# EAGLE design 1_Main (EAGLE 7.6.0)
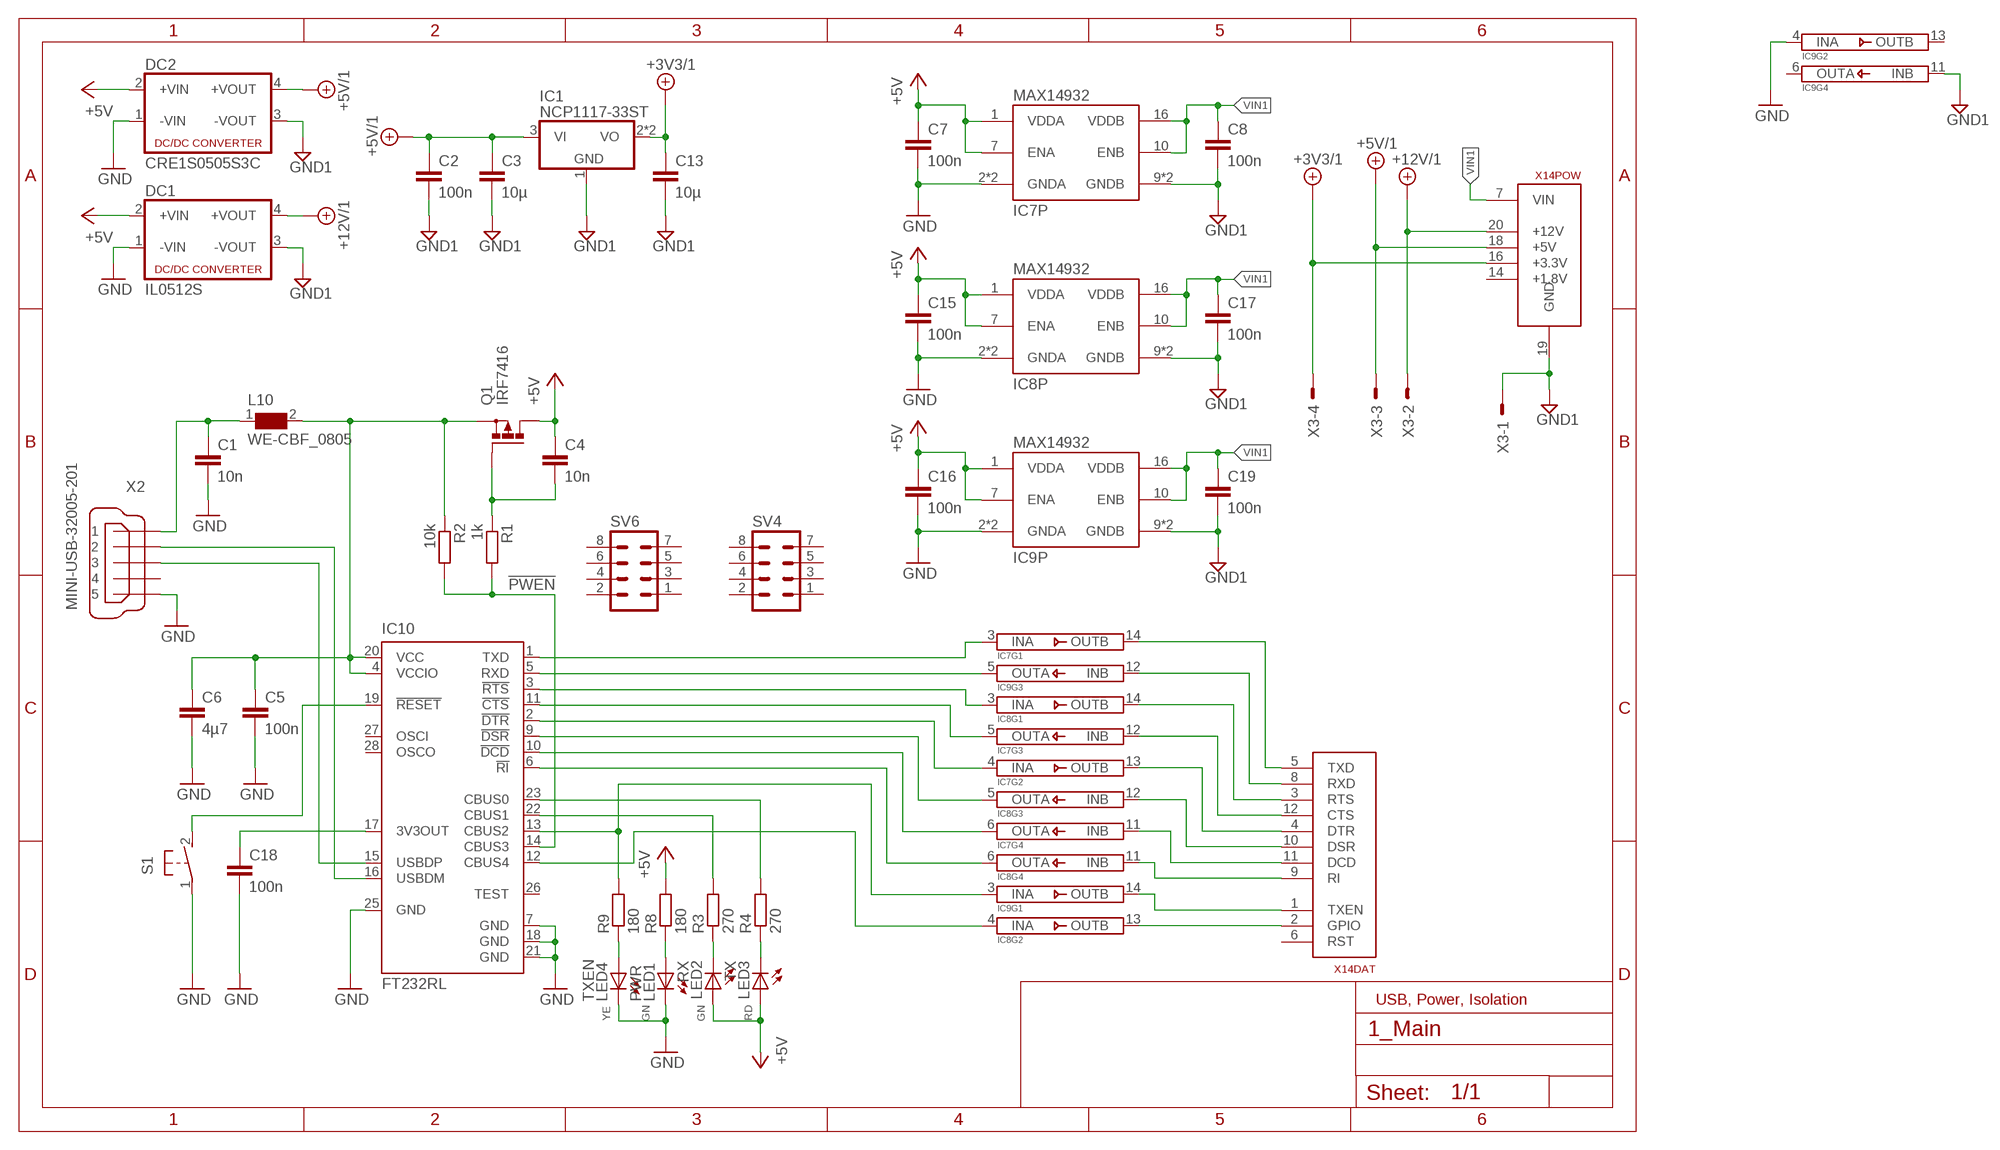
[diagram p0: schematic, sheet 1]

## Parts
C1  10n  C-EUC0805  [C0805]
C2  100n  C-EUC0805  [C0805]
C3  10µ  C-EUC0805  [C0805]
C4  10n  C-EUC0805  [C0805]
C5  100n  C-EUC0805  [C0805]
C6  4µ7  C-EUC0805  [C0805]
C7  100n  C-EUC0805  [C0805]
C8  100n  C-EUC0805  [C0805]
C13  10µ  C-EUC0805  [C0805]
C15  100n  C-EUC0805  [C0805]
C16  100n  C-EUC0805  [C0805]
C17  100n  C-EUC0805  [C0805]
C18  100n  C-EUC0805  [C0805]
C19  100n  C-EUC0805  [C0805]
DC1  IL0512S  NME  [NME]
DC2  CRE1S0505S3C  NME  [NME]
IC1  NCP1117-33ST  [SOT223]
IC7  MAX14932  [SO16]
IC8  MAX14932  [SO16]
IC9  MAX14932  [SO16]
IC10  FT232RL  [SSOP28]
L10  WE-CBF_0805  [0805]
LED1  PWR  LEDCHIPLED_0603  [CHIPLED_0603]
LED2  RX  LEDCHIPLED_0603  [CHIPLED_0603]
LED3  TX  LEDCHIPLED_0603  [CHIPLED_0603]
LED4  TXEN  LEDCHIPLED_0603  [CHIPLED_0603]
Q1  IRF7416  P-MOSFET-SO8  [SO-08]
R1  1k  R-EU_R0805  [R0805]
R2  10k  R-EU_R0805  [R0805]
R3  270  R-EU_R0805  [R0805]
R4  270  R-EU_R0805  [R0805]
R8  180  R-EU_R0805  [R0805]
R9  180  R-EU_R0805  [R0805]
S1  31-XX  [B3F-31XX]
SV4  MA04-2  [MA04-2]
SV6  MA04-2  [MA04-2]
X2  MINI-USB-32005-201  [32005-201]
X3  AKL18X-04W  [AKL182-04]
X14  ALLSERIALMM  [MAIN-THT]

## Nets
!PWEN: IC10.14(CBUS3) R1.2 R2.2
+3V3/1: C13.1 IC1.2(VO) IC1.4(VO) X3.P$4 X14.16(POW:+3.3V)
+5V: C4.1 C7.1 C15.1 C16.1 DC1.2(+VIN) DC2.2(+VIN) IC7.1(P:VDDA) IC7.7(P:ENA) IC8.1(P:VDDA) IC8.7(P:ENA) IC9.1(P:VDDA) IC9.7(P:ENA) LED2.A LED3.A Q1.5(D) Q1.6(D) Q1.7(D) Q1.8(D) R8.2
+5V/1: C2.1 C3.1 DC2.4(+VOUT) IC1.3(VI) X3.P$3 X14.18(POW:+5V)
+12V/1: DC1.4(+VOUT) X3.P$2 X14.20(POW:+12V)
GND: C1.2 C5.2 C6.2 C7.2 C15.2 C16.2 C18.2 DC1.1(-VIN) DC2.1(-VIN) IC7.2(P:GNDA) IC7.8(P:GNDA) IC8.2(P:GNDA) IC8.8(P:GNDA) IC9.2(P:GNDA) IC9.4(INA) IC9.8(P:GNDA) IC10.7(GND) IC10.18(GND) IC10.21(GND) IC10.25(GND) LED1.C LED4.C S1.1(P) X2.5
GND1: C2.2 C3.2 C8.2 C13.2 C17.2 C19.2 DC1.3(-VOUT) DC2.3(-VOUT) IC1.1(GND) IC7.9(P:GNDB) IC7.15(P:GNDB) IC8.9(P:GNDB) IC8.15(P:GNDB) IC9.9(P:GNDB) IC9.11(INB) IC9.15(P:GNDB) X3.P$1 X14.19(POW:GND)
N$3: IC9.3(INA) IC10.13(CBUS2) R9.2
N$4: LED3.C R4.1
N$5: IC10.19(!RESET) S1.2(S)
N$6: LED2.C R3.1
N$7: LED4.A R9.1
N$8: LED1.A R8.1
N$11: C1.1 L10.1 X2.1
N$13: IC8.4(INA) IC10.12(CBUS4)
N$14: IC7.3(INA) IC10.1(TXD)
N$19: IC10.16(USBDM) X2.2
N$20: IC9.5(OUTA) IC10.5(RXD)
N$21: IC10.15(USBDP) X2.3
N$22: C18.1 IC10.17(3V3OUT)
N$29: IC8.3(INA) IC10.3(!RTS)
N$32: IC7.5(OUTA) IC10.11(!CTS)
N$33: IC7.4(INA) IC10.2(!DTR)
N$34: IC8.5(OUTA) IC10.9(!DSR)
N$35: IC7.6(OUTA) IC10.10(!DCD)
N$36: IC8.6(OUTA) IC10.6(!RI)
N$38: C5.1 C6.1 IC10.4(VCCIO) IC10.20(VCC) L10.2 Q1.1(S) Q1.2(S) Q1.3(S) R2.1
N$42: C4.2 Q1.4(G) R1.1
N$80: IC7.14(OUTB) X14.5(DAT:TXD)
N$81: IC9.12(INB) X14.8(DAT:RXD)
N$82: IC8.14(OUTB) X14.3(DAT:RTS)
N$83: IC7.12(INB) X14.12(DAT:CTS)
N$84: IC7.13(OUTB) X14.4(DAT:DTR)
N$85: IC8.12(INB) X14.10(DAT:DSR)
N$86: IC7.11(INB) X14.11(DAT:DCD)
N$87: IC8.11(INB) X14.9(DAT:RI)
N$88: IC9.14(OUTB) X14.1(DAT:TXEN)
N$89: IC8.13(OUTB) X14.2(DAT:GPIO)
RXLED: IC10.22(CBUS1) R3.2
TXLED: IC10.23(CBUS0) R4.2
VIN1: C8.1 C17.1 C19.1 IC7.10(P:ENB) IC7.16(P:VDDB) IC8.10(P:ENB) IC8.16(P:VDDB) IC9.10(P:ENB) IC9.16(P:VDDB) X14.7(POW:VIN)
Unconnected: IC9.6(OUTA) IC9.13(OUTB) IC10.26(TEST) IC10.27(OSCI) IC10.28(OSCO) SV4.1 SV4.2 SV4.3 SV4.4 SV4.5 SV4.6 SV4.7 SV4.8 SV6.1 SV6.2 SV6.3 SV6.4 SV6.5 SV6.6 SV6.7 SV6.8 X2.4 X14.6(DAT:RST) X14.14(POW:+1.8V)

## Notes on the sheet
- USB, Power, Isolation

## Library data of the parts
C1-C8 C13 C15-C19 = rcl:C-EU: CAPACITOR, European symbol
DC1 DC2 = dc-dc-converter:NME: DC-DC CONVERTER; MF: C & D TECHNOLOGIES, INC; MPN: NME1205D; OC_FARNELL: 1021466; OC_NEWARK: 98B8198
IC1 = linear:NCP1117
IC7-IC9 = max14932:MAX14932
IC10 = ftdichip:FT232R: Source: http://www.ftdichip.com/Documents/DataSheets/DS_FT232R_v104.pdf; MPN: FT232RL; OC_FARNELL: 1146032; OC_NEWARK: 91K9918
L10 = EagleLibrary_Wuerth_Elektronik_eiSos_Version_6-12:WE-CBF: SMD EMI Suppression Ferrite Beads WE-CBF - Excellent anti-EMI properties - Low DC-restistance - Impedances till 3000 ohms - Rated current up to 6 A -- Reliable Ni-Sn electrodes -- Perfect as data lined filter and for uncoupling of distribution voltage
LED1 LED2 = led:LED: LED OSRAM: - CHIPLED LG R971, LG N971, LY N971, LG Q971, LY Q971, LO R971, LY R971 LH N974, LH R974 LS Q976, LO Q976, LY Q976 LO Q996 - Hyper CHIPLED LW Q18S LB Q993, LB Q99A, LB R99A - SideLED LS A670, LO A670, LY A670, LG A670, LP A670 LB A673, LV A673, LT A673, LW A673 LH A674 LY A675 LS A676, LA A676, LO A676, LY A676, LW A676 LS A679, LY A679, LG A679 - Hyper Micro SIDELED® LS Y876, LA Y876, LO Y876, LY Y876 LT Y87S - SmartLED LW L88C, LW L88S LB L89C, LB L89S, LG L890 LS L89K, LO L89K, LY L89K LS L896, LA L896, LO L896, LY L896 - TOPLED LS T670, LO T670, LY T670, LG T670, LP T670 LSG T670, LSP T670, LSY T670, LOP T670, LYG T670 LG T671, LOG T671, LSG T671 LB T673, LV T673, LT T673, LW T673 LH T674 LS T676, LA T676, LO T676, LY T676, LB T676, LH T676, LSB T676, LW T676 LB T67C, LV T67C, LT T67C, LS T67K, LO T67K, LY T67K, LW E67C LS E67B, LA E67B, LO E67B, LY E67B, LB E67C, LV E67C, LT E67C LW T67C LS T679, LY T679, LG T679 LS T770, LO T770, LY T770, LG T770, LP T770 LB T773, LV T773, LT T773, LW T773 LH T774 LS E675, LA E675, LY E675, LS T675 LS T776, LA T776, LO T776, LY T776, LB T776 LHGB T686 LT T68C, LB T68C - Hyper Mini TOPLED® LB M676 - Mini TOPLED Santana® LG M470 LS M47K, LO M47K, LY M47K Source: http://www.osram.convergy.de LUXEON: - LUMILED® LXK2-PW12-R00, LXK2-PW12-S00, LXK2-PW14-U00, LXK2-PW14-V00 LXK2-PM12-R00, LXK2-PM12-S00, LXK2-PM14-U00 LXK2-PE12-Q00, LXK2-PE12-R00, LXK2-PE12-S00, LXK2-PE14-T00, LXK2-PE14-U00 LXK2-PB12-K00, LXK2-PB12-L00, LXK2-PB12-M00, LXK2-PB14-N00, LXK2-PB14-P00, LXK2-PB14-Q00 LXK2-PR12-L00, LXK2-PR12-M00, LXK2-PR14-Q00, LXK2-PR14-R00 LXK2-PD12-Q00, LXK2-PD12-R00, LXK2-PD12-S00 LXK2-PH12-R00, LXK2-PH12-S00 LXK2-PL12-P00, LXK2-PL12-Q00, LXK2-PL12-R00 Source: www.luxeon.com KINGBRIGHT: KA-3528ASYC Source: www.kingbright.com; COLOR: GN
LED3 = led:LED: LED OSRAM: - CHIPLED LG R971, LG N971, LY N971, LG Q971, LY Q971, LO R971, LY R971 LH N974, LH R974 LS Q976, LO Q976, LY Q976 LO Q996 - Hyper CHIPLED LW Q18S LB Q993, LB Q99A, LB R99A - SideLED LS A670, LO A670, LY A670, LG A670, LP A670 LB A673, LV A673, LT A673, LW A673 LH A674 LY A675 LS A676, LA A676, LO A676, LY A676, LW A676 LS A679, LY A679, LG A679 - Hyper Micro SIDELED® LS Y876, LA Y876, LO Y876, LY Y876 LT Y87S - SmartLED LW L88C, LW L88S LB L89C, LB L89S, LG L890 LS L89K, LO L89K, LY L89K LS L896, LA L896, LO L896, LY L896 - TOPLED LS T670, LO T670, LY T670, LG T670, LP T670 LSG T670, LSP T670, LSY T670, LOP T670, LYG T670 LG T671, LOG T671, LSG T671 LB T673, LV T673, LT T673, LW T673 LH T674 LS T676, LA T676, LO T676, LY T676, LB T676, LH T676, LSB T676, LW T676 LB T67C, LV T67C, LT T67C, LS T67K, LO T67K, LY T67K, LW E67C LS E67B, LA E67B, LO E67B, LY E67B, LB E67C, LV E67C, LT E67C LW T67C LS T679, LY T679, LG T679 LS T770, LO T770, LY T770, LG T770, LP T770 LB T773, LV T773, LT T773, LW T773 LH T774 LS E675, LA E675, LY E675, LS T675 LS T776, LA T776, LO T776, LY T776, LB T776 LHGB T686 LT T68C, LB T68C - Hyper Mini TOPLED® LB M676 - Mini TOPLED Santana® LG M470 LS M47K, LO M47K, LY M47K Source: http://www.osram.convergy.de LUXEON: - LUMILED® LXK2-PW12-R00, LXK2-PW12-S00, LXK2-PW14-U00, LXK2-PW14-V00 LXK2-PM12-R00, LXK2-PM12-S00, LXK2-PM14-U00 LXK2-PE12-Q00, LXK2-PE12-R00, LXK2-PE12-S00, LXK2-PE14-T00, LXK2-PE14-U00 LXK2-PB12-K00, LXK2-PB12-L00, LXK2-PB12-M00, LXK2-PB14-N00, LXK2-PB14-P00, LXK2-PB14-Q00 LXK2-PR12-L00, LXK2-PR12-M00, LXK2-PR14-Q00, LXK2-PR14-R00 LXK2-PD12-Q00, LXK2-PD12-R00, LXK2-PD12-S00 LXK2-PH12-R00, LXK2-PH12-S00 LXK2-PL12-P00, LXK2-PL12-Q00, LXK2-PL12-R00 Source: www.luxeon.com KINGBRIGHT: KA-3528ASYC Source: www.kingbright.com; COLOR: RD
LED4 = led:LED: LED OSRAM: - CHIPLED LG R971, LG N971, LY N971, LG Q971, LY Q971, LO R971, LY R971 LH N974, LH R974 LS Q976, LO Q976, LY Q976 LO Q996 - Hyper CHIPLED LW Q18S LB Q993, LB Q99A, LB R99A - SideLED LS A670, LO A670, LY A670, LG A670, LP A670 LB A673, LV A673, LT A673, LW A673 LH A674 LY A675 LS A676, LA A676, LO A676, LY A676, LW A676 LS A679, LY A679, LG A679 - Hyper Micro SIDELED® LS Y876, LA Y876, LO Y876, LY Y876 LT Y87S - SmartLED LW L88C, LW L88S LB L89C, LB L89S, LG L890 LS L89K, LO L89K, LY L89K LS L896, LA L896, LO L896, LY L896 - TOPLED LS T670, LO T670, LY T670, LG T670, LP T670 LSG T670, LSP T670, LSY T670, LOP T670, LYG T670 LG T671, LOG T671, LSG T671 LB T673, LV T673, LT T673, LW T673 LH T674 LS T676, LA T676, LO T676, LY T676, LB T676, LH T676, LSB T676, LW T676 LB T67C, LV T67C, LT T67C, LS T67K, LO T67K, LY T67K, LW E67C LS E67B, LA E67B, LO E67B, LY E67B, LB E67C, LV E67C, LT E67C LW T67C LS T679, LY T679, LG T679 LS T770, LO T770, LY T770, LG T770, LP T770 LB T773, LV T773, LT T773, LW T773 LH T774 LS E675, LA E675, LY E675, LS T675 LS T776, LA T776, LO T776, LY T776, LB T776 LHGB T686 LT T68C, LB T68C - Hyper Mini TOPLED® LB M676 - Mini TOPLED Santana® LG M470 LS M47K, LO M47K, LY M47K Source: http://www.osram.convergy.de LUXEON: - LUMILED® LXK2-PW12-R00, LXK2-PW12-S00, LXK2-PW14-U00, LXK2-PW14-V00 LXK2-PM12-R00, LXK2-PM12-S00, LXK2-PM14-U00 LXK2-PE12-Q00, LXK2-PE12-R00, LXK2-PE12-S00, LXK2-PE14-T00, LXK2-PE14-U00 LXK2-PB12-K00, LXK2-PB12-L00, LXK2-PB12-M00, LXK2-PB14-N00, LXK2-PB14-P00, LXK2-PB14-Q00 LXK2-PR12-L00, LXK2-PR12-M00, LXK2-PR14-Q00, LXK2-PR14-R00 LXK2-PD12-Q00, LXK2-PD12-R00, LXK2-PD12-S00 LXK2-PH12-R00, LXK2-PH12-S00 LXK2-PL12-P00, LXK2-PL12-Q00, LXK2-PL12-R00 Source: www.luxeon.com KINGBRIGHT: KA-3528ASYC Source: www.kingbright.com; COLOR: YE
Q1 = transistor-power:P-MOSFET-SO8: P-Channel MOSFET Example: FDS4435A; P-Channel Logic Level PowerTrench® MOSFET FDS4465; P-Channel 1.8V Specified PowerTrench® MOSFET Source: www.fairchildsemi.com
R1-R4 R8 R9 = rcl:R-EU_: RESISTOR, European symbol
S1 = switch-omron:31-XX: OMRON SWITCH; MPN: B3F-3100; OC_FARNELL: 959704; OC_NEWARK: 36M3582
SV4 SV6 = con-lstb:MA04-2: PIN HEADER; OC_FARNELL: unknown; OC_NEWARK: unknown
X2 = con-cypressindustries:MINI-USB-: MINI USB-B Conector Source: www.cypressindustries.com; OC_FARNELL: unknown; OC_NEWARK: unknown
X3 = con-riacon_akl:AKL18X-04: Riacon AKL18X Steckverbinder 4-Pol Grid = 3,5mm
X14 = AllSerial:ALLSERIAL

## Board
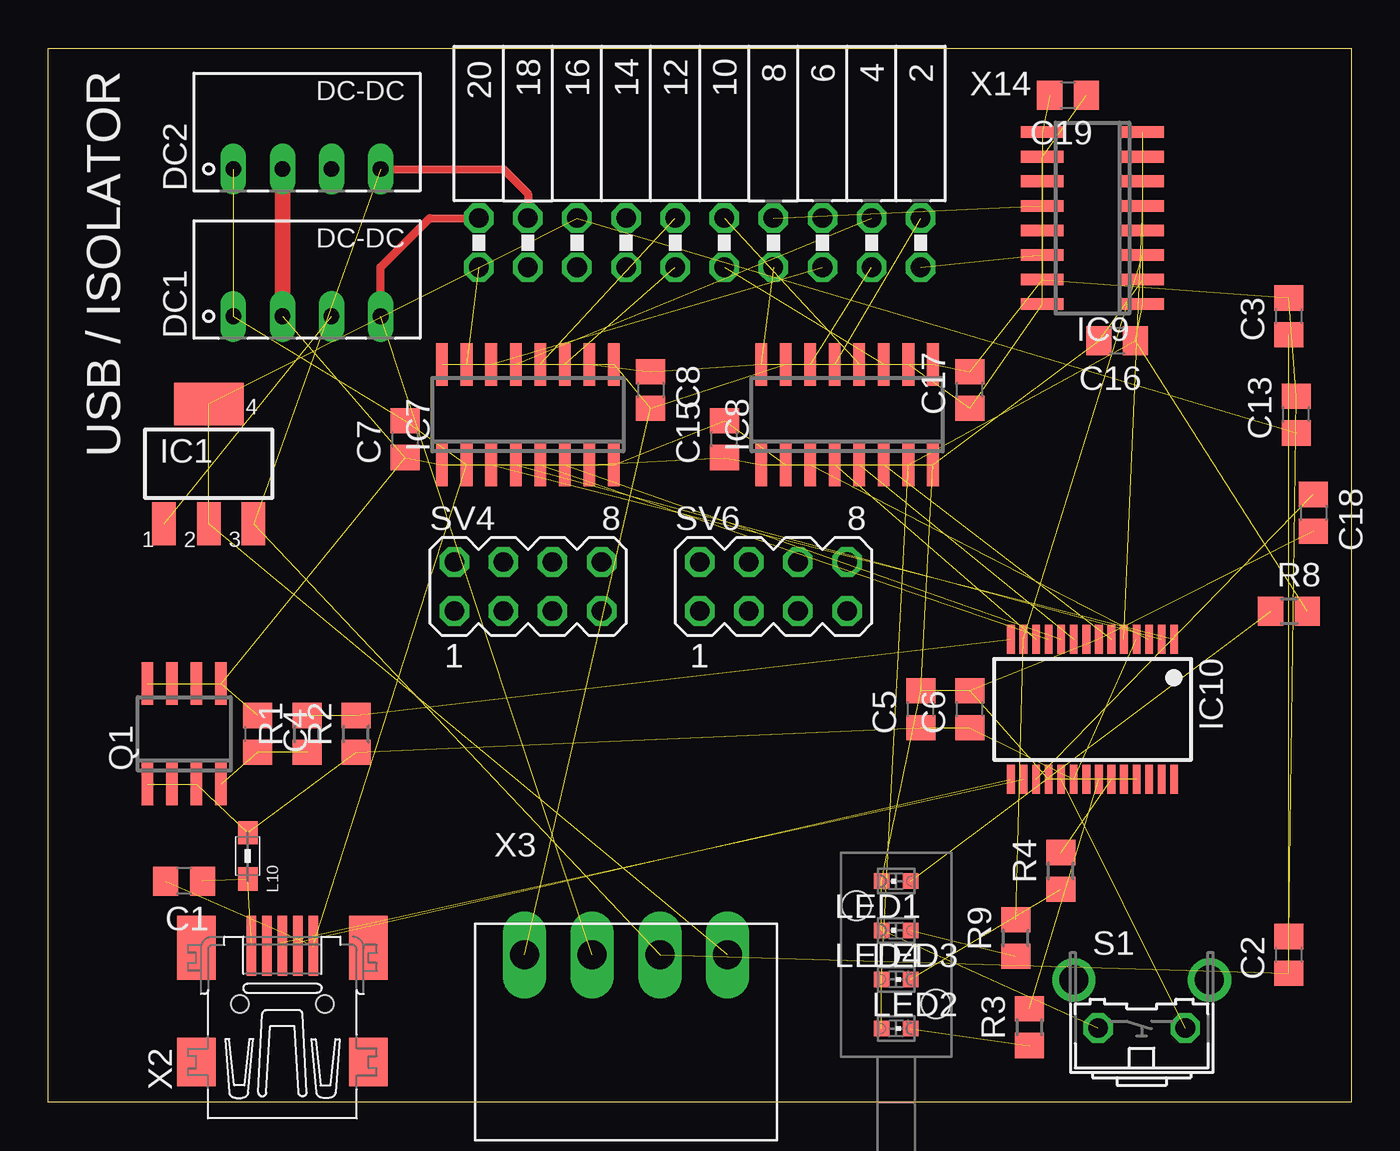
[diagram p1: board, top side]
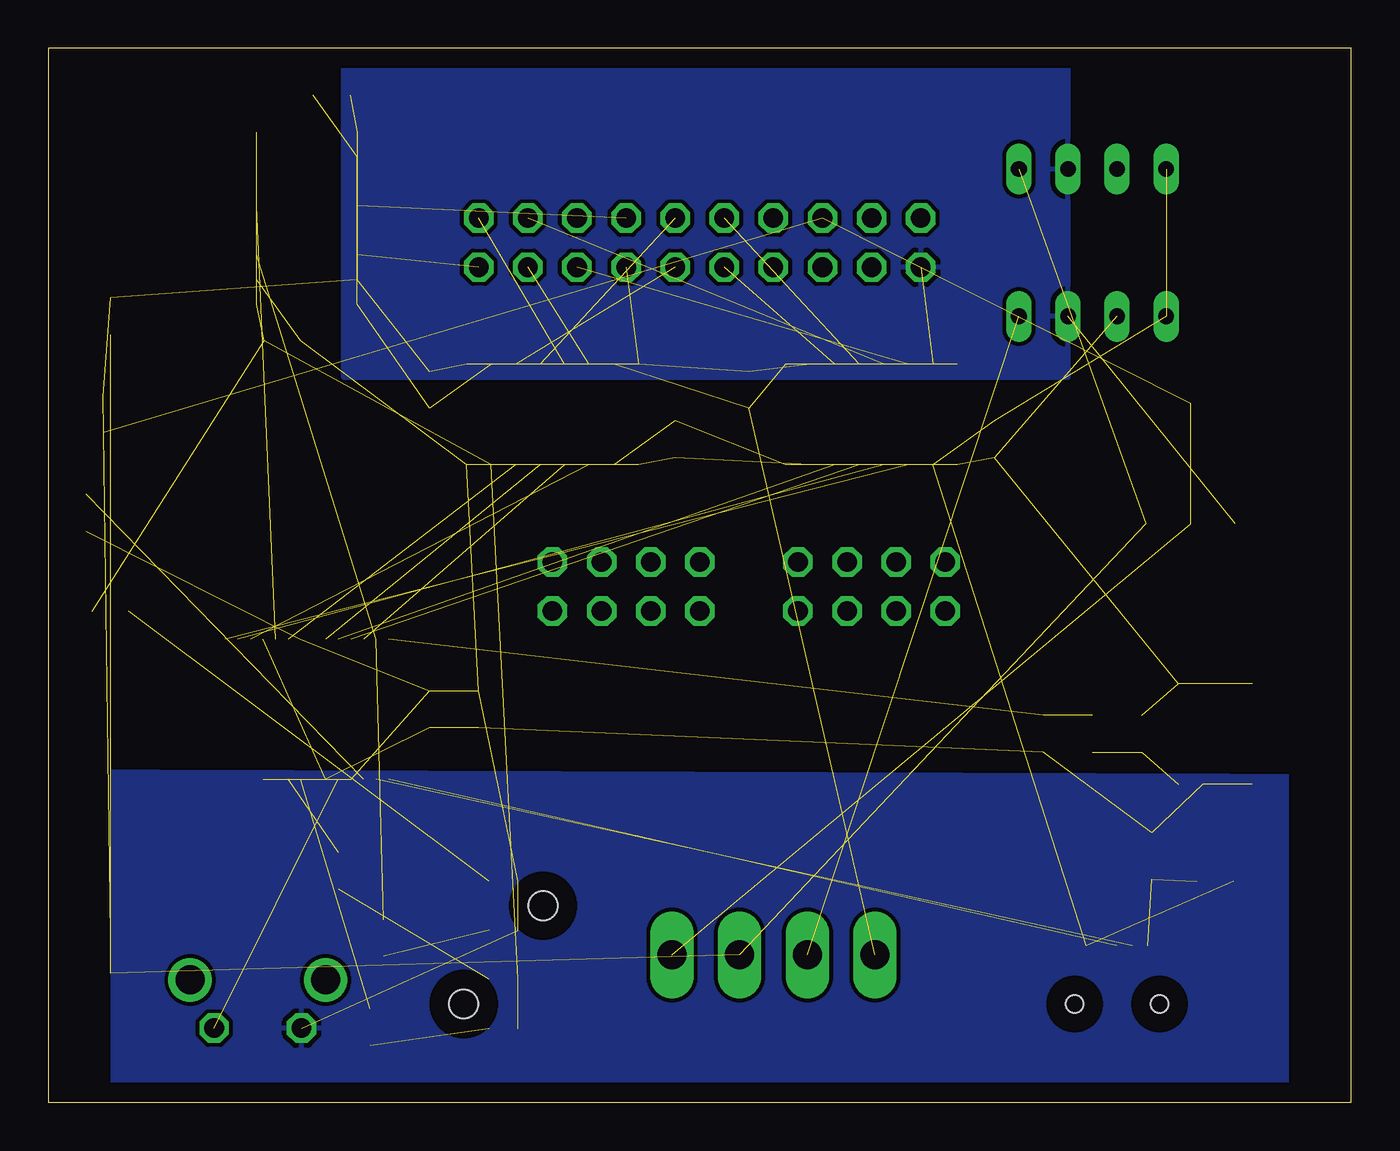
[diagram p2: board, bottom side, seen from below]

Size 67.4 x 54.5 mm. Coordinates in mm from the lower left corner, seen from the top.
Copper layers (1*16): Top 0.035mm / dielectric 1.5mm / Bottom 0.035mm
Design rules "default *": minimum track width 10mil, minimum drill 24mil, track to track 8mil, track to pad 8mil, pad to pad 8mil, via to via 8mil, smd to smd 8mil, copper to edge 40mil, drill to drill 8mil, minimum pad ring 10mil, minimum via ring 8mil, stop-mask expansion 4mil, vias tented up to drill 0.3mm, thermal gap 10mil

### Footprints (pad centres in the part's own frame; a part is rotated, then mirrored left to right if it is on the bottom)
C0805 = smd 1.3 x 1.5: 1 -0.95,0; 2 0.95,0
NME = drill 0.813 long: 1 0,3.81; 2 0,1.27; 3 0,-1.27; 4 0,-3.81
SOT223 = smd 1.219 x 2.235: 1 -2.311,-3.099; 2 0,-3.099; 3 2.311,-3.099 | smd 3.6 x 2.2: 4 0,3.099
SO16 = smd 0.6 x 2.2: 1 -4.445,-2.6; 2 -3.175,-2.6; 3 -1.905,-2.6; 4 -0.635,-2.6; 5 0.635,-2.6; 6 1.905,-2.6; 7 3.175,-2.6; 8 4.445,-2.6; 9 4.445,2.6; 10 3.175,2.6; 11 1.905,2.6; 12 0.635,2.6; 13 -0.635,2.6; 14 -1.905,2.6; 15 -3.175,2.6; 16 -4.445,2.6
SSOP28 = smd 0.4 x 1.5: 1 -4.225,-3.625; 2 -3.575,-3.625; 3 -2.925,-3.625; 4 -2.275,-3.625; 5 -1.625,-3.625; 6 -0.975,-3.625; 7 -0.325,-3.625; 8 0.325,-3.625; 9 0.975,-3.625; 10 1.625,-3.625; 11 2.275,-3.625; 12 2.925,-3.625; 13 3.575,-3.625; 14 4.225,-3.625; 15 4.225,3.625; 16 3.575,3.625; 17 2.925,3.625; 18 2.275,3.625; 19 1.625,3.625; 20 0.975,3.625; 21 0.325,3.625; 22 -0.325,3.625; 23 -0.975,3.625; 24 -1.625,3.625; 25 -2.275,3.625; 26 -2.925,3.625; 27 -3.575,3.625; 28 -4.225,3.625
0805 = smd 1.2 x 1: 1 -1.2,0; 2 1.2,0
CHIPLED_0603 = smd 0.8 x 0.8: A 0,-0.75; C 0,0.75
SO-08 = smd 0.6 x 2.2: 1 -1.905,-2.6; 2 -0.635,-2.6; 3 0.635,-2.6; 4 1.905,-2.6; 5 1.905,2.6; 6 0.635,2.6; 7 -0.635,2.6; 8 -1.905,2.6
R0805 = smd 1.3 x 1.5: 1 -0.95,0; 2 0.95,0
B3F-31XX = drill 1.016 octagon: 1 -2.261,-1.245; 2 2.261,-1.245 | drill 1.499 pad 2.159: 3 -3.505,1.245; 4 3.505,1.245
MA04-2 = drill 1.016 octagon: 1 -3.81,-1.27; 2 -3.81,1.27; 3 -1.27,-1.27; 4 -1.27,1.27; 5 1.27,-1.27; 6 1.27,1.27; 7 3.81,-1.27; 8 3.81,1.27
1296.1004 = hole 1.5: 2.05,-2.54; -2.05,2.54
32005-201 = smd 3.1 x 0.5: 1 3,1.6; 2 3,0.8; 3 3,0; 4 3,-0.8; 5 3,-1.6 | smd 2.5 x 2: M1 -3,-4.45; M2 -3,4.45 | smd 3.3 x 2: M3 2.9,4.45; M4 2.9,-4.45 | hole 0.9: 0,2.2; 0,-2.2
AKL182-04 = drill 1.5 pad 2.184 long: P$1 -5.25,0; P$2 -1.75,0; P$3 1.75,0; P$4 5.25,0
MAIN-THT = drill 1.016 octagon: 1 11.43,43.18; 2 11.43,45.72; 3 8.89,43.18; 4 8.89,45.72; 5 6.35,43.18; 6 6.35,45.72; 7 3.81,43.18; 8 3.81,45.72; 9 1.27,43.18; 10 1.27,45.72; 11 -1.27,43.18; 12 -1.27,45.72; 13 -3.81,43.18; 14 -3.81,45.72; 15 -6.35,43.18; 16 -6.35,45.72; 17 -8.89,43.18; 18 -8.89,45.72; 19 -11.43,43.18; 20 -11.43,45.72

### Placement (x,y rotation side)
C1  7.03,11.43 180 top
C2  64.18,7.62 90 top
C3  64.18,40.64 90 top
C4  10.84,19.05 270 top
C5  45.13,20.32 90 top
C6  47.67,20.32 90 top
C7  18.46,34.29 90 top
C8  31.16,36.83 270 top
C13  64.55,35.56 90 top
C15  34.97,34.29 90 top
C16  55.29,39.37 180 top
C17  47.67,36.83 90 top
C18  65.45,30.48 270 top
C19  52.75,52.07 180 top
DC1  13.38,40.64 90 top
DC2  13.38,48.26 90 top
IC1  8.3,33.02 0 top
IC7  24.81,35.56 0 top
IC8  41.32,35.56 0 top
IC9  54.02,45.72 90 top
IC10  54.02,20.32 180 top
L10  10.32,12.74 90 top
LED1  43.86,11.43 90 top
LED2  43.86,3.81 270 top
LED3  43.86,6.35 270 top
LED4  43.86,8.89 90 top
Q1  7.03,19.05 0 top
R1  13.38,19.05 90 top
R2  15.92,19.05 90 top
R3  50.76,3.88 90 top
R4  52.38,11.96 90 top
R8  64.18,25.4 0 top
R9  50.05,8.49 90 top
S1  56.56,5.08 0 top
SV4  24.81,26.67 0 top
SV6  37.51,26.67 0 top
U$3  [1296.1004]  43.86,7.62 180 top
X2  12.11,5.08 90 top
X3  29.89,7.62 0 top
X14  33.7,0 0 top

### Tracks (layer width: path | path; a pad name or v marks a point on that pad's centre or on a via)
!PWEN  (2 unrouted)
+3V3/1  (4 unrouted)
+5V  (17 unrouted)
  Top 0.813: DC2.2 DC1.2
+5V/1  (4 unrouted)
  Top 0.406: DC2.4 23.54,48.26 24.81,46.99 X14.18
+12V/1  (1 unrouted)
  Top 0.406: DC1.4 17.19,43.18 19.73,45.72 X14.20
GND  (23 unrouted)
  pour Bottom: -0.59,0 68.55,0 68.55,17.12 -0.59,16.85
GND1  (15 unrouted)
  pour Bottom: 14.65,54.61 14.65,37.47 20.37,37.47 52.12,37.47 52.12,54.61
N$3  (2 unrouted)
N$4  (1 unrouted)
N$5  (1 unrouted)
N$6  (1 unrouted)
N$7  (1 unrouted)
N$8  (1 unrouted)
N$11  (2 unrouted)
N$13  (1 unrouted)
N$14  (1 unrouted)
N$19  (1 unrouted)
N$20  (1 unrouted)
N$21  (1 unrouted)
N$22  (1 unrouted)
N$29  (1 unrouted)
N$32  (1 unrouted)
N$33  (1 unrouted)
N$34  (1 unrouted)
N$35  (1 unrouted)
N$36  (1 unrouted)
N$38  (8 unrouted)
N$42  (2 unrouted)
N$80  (1 unrouted)
N$81  (1 unrouted)
N$82  (1 unrouted)
N$83  (1 unrouted)
N$84  (1 unrouted)
N$85  (1 unrouted)
N$86  (1 unrouted)
N$87  (1 unrouted)
N$88  (1 unrouted)
N$89  (1 unrouted)
RXLED  (1 unrouted)
TXLED  (1 unrouted)
VIN1  (9 unrouted)

### Text on the board
tPlace: USB / ISOLATOR